# EAGLE schematic Channel Display v2 (EAGLE 6.6.0)
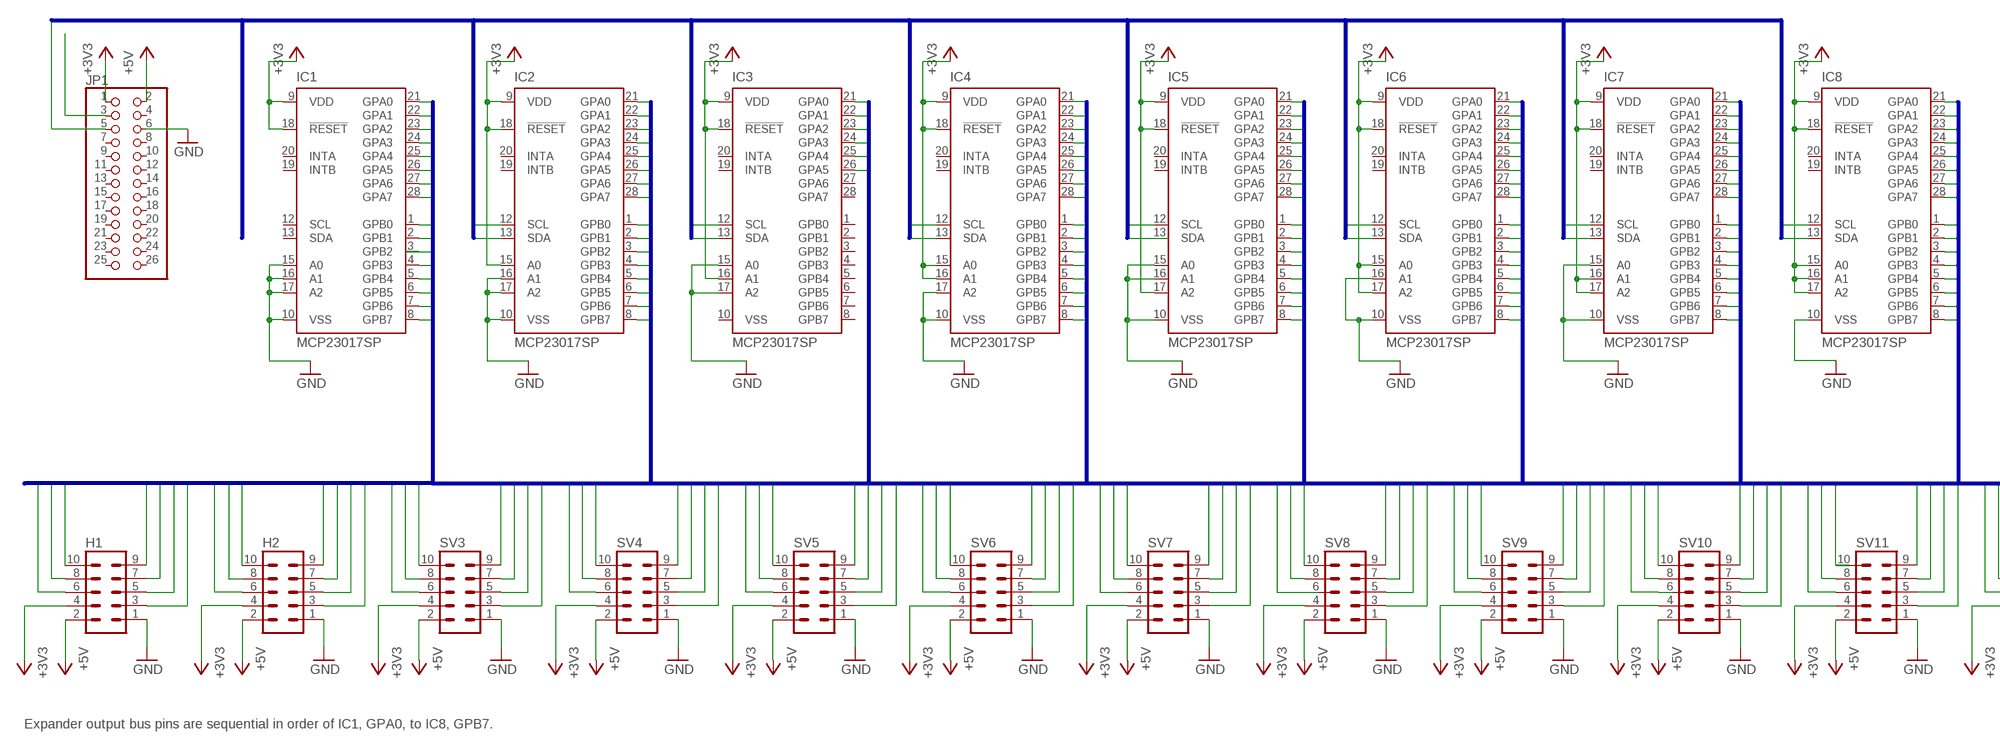
[diagram p0: schematic, sheet 1, part 1 of 2]
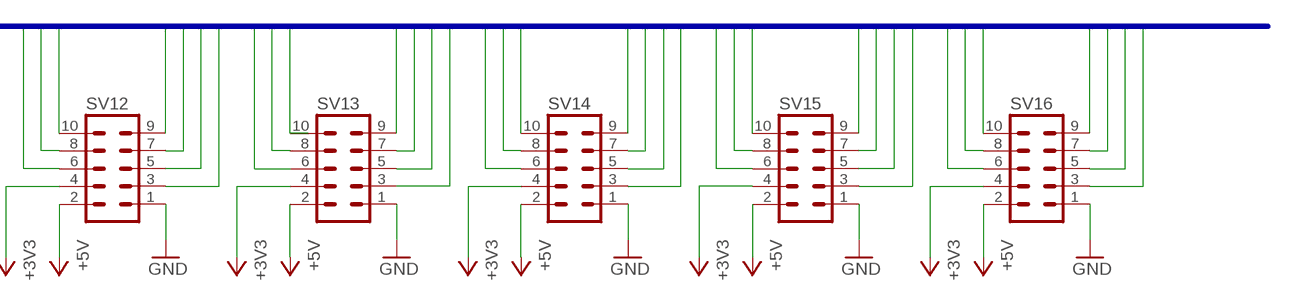
[diagram p1: schematic, sheet 1, part 2 of 2]

## Parts
H1  MA05-2  [MA05-2]
H2  MA05-2  [MA05-2]
IC1  MCP23017SP  [DIL28-3]
IC2  MCP23017SP  [DIL28-3]
IC3  MCP23017SP  [DIL28-3]
IC4  MCP23017SP  [DIL28-3]
IC5  MCP23017SP  [DIL28-3]
IC6  MCP23017SP  [DIL28-3]
IC7  MCP23017SP  [DIL28-3]
IC8  MCP23017SP  [DIL28-3]
JP1  PINHD-2X13  [2X13]
SV3  MA05-2  [MA05-2]
SV4  MA05-2  [MA05-2]
SV5  MA05-2  [MA05-2]
SV6  MA05-2  [MA05-2]
SV7  MA05-2  [MA05-2]
SV8  MA05-2  [MA05-2]
SV9  MA05-2  [MA05-2]
SV10  MA05-2  [MA05-2]
SV11  MA05-2  [MA05-2]
SV12  MA05-2  [MA05-2]
SV13  MA05-2  [MA05-2]
SV14  MA05-2  [MA05-2]
SV15  MA05-2  [MA05-2]
SV16  MA05-2  [MA05-2]

## Nets
+3V3: H1.4 H2.4 IC1.9(VDD) IC1.18(!RESET) IC2.9(VDD) IC2.15(A0) IC2.18(!RESET) IC3.9(VDD) IC3.16(A1) IC3.18(!RESET) IC4.9(VDD) IC4.15(A0) IC4.16(A1) IC4.18(!RESET) IC5.9(VDD) IC5.17(A2) IC5.18(!RESET) IC6.9(VDD) IC6.15(A0) IC6.17(A2) IC6.18(!RESET) IC7.9(VDD) IC7.16(A1) IC7.17(A2) IC7.18(!RESET) IC8.9(VDD) IC8.15(A0) IC8.16(A1) IC8.17(A2) IC8.18(!RESET) JP1.1 SV3.4 SV4.4 SV5.4 SV6.4 SV7.4 SV8.4 SV9.4 SV10.4 SV11.4 SV12.4 SV13.4 SV14.4 SV15.4 SV16.4
+5V: H1.2 H2.2 JP1.2 SV3.2 SV4.2 SV5.2 SV6.2 SV7.2 SV8.2 SV9.2 SV10.2 SV11.2 SV12.2 SV13.2 SV14.2 SV15.2 SV16.2
B$1: IC2.12(SCL) IC2.13(SDA) IC3.12(SCL) IC3.13(SDA) IC4.12(SCL) IC4.13(SDA) IC5.12(SCL) IC6.12(SCL) IC6.13(SDA) IC7.12(SCL) IC7.13(SDA) IC8.12(SCL) IC8.13(SDA) JP1.3 JP1.5
B$2: H1.3 H1.5 H1.6 H1.7 H1.8 H1.9 H1.10 H2.3 H2.5 H2.6 H2.7 H2.8 H2.9 H2.10 IC1.1(GPB0) IC1.2(GPB1) IC1.4(GPB3) IC1.5(GPB4) IC1.6(GPB5) IC1.7(GPB6) IC1.8(GPB7) IC1.21(GPA0) IC1.22(GPA1) IC1.23(GPA2) IC1.24(GPA3) IC1.25(GPA4) IC1.26(GPA5) IC1.27(GPA6) IC1.28(GPA7) IC2.1(GPB0) IC2.2(GPB1) IC2.3(GPB2) IC2.4(GPB3) IC2.5(GPB4) IC2.6(GPB5) IC2.7(GPB6) IC2.8(GPB7) IC2.21(GPA0) IC2.22(GPA1) IC2.23(GPA2) IC2.24(GPA3) IC2.25(GPA4) IC2.26(GPA5) IC2.27(GPA6) IC2.28(GPA7) IC3.21(GPA0) IC3.22(GPA1) IC3.23(GPA2) IC3.24(GPA3) IC3.25(GPA4) IC3.26(GPA5) IC4.1(GPB0) IC4.2(GPB1) IC4.3(GPB2) IC4.4(GPB3) IC4.5(GPB4) IC4.6(GPB5) IC4.7(GPB6) IC4.8(GPB7) IC4.21(GPA0) IC4.22(GPA1) IC4.23(GPA2) IC4.24(GPA3) IC4.25(GPA4) IC4.26(GPA5) IC4.27(GPA6) IC4.28(GPA7) IC5.1(GPB0) IC5.2(GPB1) IC5.3(GPB2) IC5.4(GPB3) IC5.5(GPB4) IC5.6(GPB5) IC5.7(GPB6) IC5.8(GPB7) IC5.21(GPA0) IC5.22(GPA1) IC5.23(GPA2) IC5.24(GPA3) IC5.25(GPA4) IC5.26(GPA5) IC5.27(GPA6) IC5.28(GPA7) IC6.1(GPB0) IC6.2(GPB1) IC6.3(GPB2) IC6.4(GPB3) IC6.5(GPB4) IC6.6(GPB5) IC6.7(GPB6) IC6.8(GPB7) IC6.21(GPA0) IC6.22(GPA1) IC6.23(GPA2) IC6.24(GPA3) IC6.25(GPA4) IC6.26(GPA5) IC6.27(GPA6) IC6.28(GPA7) IC7.1(GPB0) IC7.2(GPB1) IC7.3(GPB2) IC7.4(GPB3) IC7.5(GPB4) IC7.6(GPB5) IC7.7(GPB6) IC7.8(GPB7) IC7.21(GPA0) IC7.22(GPA1) IC7.23(GPA2) IC7.24(GPA3) IC7.25(GPA4) IC7.26(GPA5) IC7.27(GPA6) IC7.28(GPA7) IC8.1(GPB0) IC8.2(GPB1) IC8.3(GPB2) IC8.4(GPB3) IC8.5(GPB4) IC8.6(GPB5) IC8.7(GPB6) IC8.8(GPB7) IC8.21(GPA0) IC8.22(GPA1) IC8.23(GPA2) IC8.24(GPA3) IC8.25(GPA4) IC8.26(GPA5) IC8.27(GPA6) IC8.28(GPA7) SV3.3 SV3.5 SV3.6 SV3.7 SV3.8 SV3.9 SV3.10 SV4.3 SV4.5 SV4.6 SV4.7 SV4.8 SV4.9 SV4.10 SV5.3 SV5.5 SV5.6 SV5.7 SV5.8 SV5.9 SV5.10 SV6.3 SV6.5 SV6.6 SV6.7 SV6.8 SV6.9 SV6.10 SV7.3 SV7.5 SV7.6 SV7.7 SV7.8 SV7.9 SV7.10 SV8.3 SV8.5 SV8.7 SV8.8 SV8.9 SV8.10 SV9.3 SV9.5 SV9.6 SV9.7 SV9.8 SV9.9 SV9.10 SV10.3 SV10.5 SV10.6 SV10.7 SV10.8 SV10.9 SV10.10 SV11.3 SV11.5 SV11.6 SV11.7 SV11.8 SV11.9 SV12.3 SV12.5 SV12.6 SV12.7 SV12.8 SV12.9 SV12.10 SV13.3 SV13.5 SV13.6 SV13.7 SV13.8 SV13.9 SV14.3 SV14.5 SV14.6 SV14.7 SV14.8 SV14.9 SV14.10 SV15.3 SV15.5 SV15.6 SV15.7 SV15.8 SV15.9 SV15.10 SV16.3 SV16.5 SV16.6 SV16.7 SV16.8 SV16.9 SV16.10
GND: H1.1 H2.1 IC1.10(VSS) IC1.15(A0) IC1.16(A1) IC1.17(A2) IC2.10(VSS) IC2.16(A1) IC2.17(A2) IC3.15(A0) IC3.17(A2) IC4.10(VSS) IC4.17(A2) IC5.10(VSS) IC5.15(A0) IC5.16(A1) IC6.10(VSS) IC6.16(A1) IC7.10(VSS) IC7.15(A0) IC8.10(VSS) JP1.6 SV3.1 SV4.1 SV5.1 SV6.1 SV7.1 SV8.1 SV9.1 SV10.1 SV11.1 SV12.1 SV13.1 SV14.1 SV15.1 SV16.1
Unconnected: IC1.3(GPB2) IC1.12(SCL) IC1.13(SDA) IC1.19(INTB) IC1.20(INTA) IC2.19(INTB) IC2.20(INTA) IC3.1(GPB0) IC3.2(GPB1) IC3.3(GPB2) IC3.4(GPB3) IC3.5(GPB4) IC3.6(GPB5) IC3.7(GPB6) IC3.8(GPB7) IC3.19(INTB) IC3.20(INTA) IC3.27(GPA6) IC3.28(GPA7) IC4.19(INTB) IC4.20(INTA) IC5.13(SDA) IC5.19(INTB) IC5.20(INTA) IC6.19(INTB) IC6.20(INTA) IC7.19(INTB) IC7.20(INTA) IC8.19(INTB) IC8.20(INTA) JP1.4 JP1.7 JP1.8 JP1.9 JP1.10 JP1.11 JP1.12 JP1.13 JP1.14 JP1.15 JP1.16 JP1.17 JP1.18 JP1.19 JP1.20 JP1.21 JP1.22 JP1.23 JP1.24 JP1.25 JP1.26 SV8.6 SV11.10 SV13.10

## Buses
B$1
B$2

## Notes on the sheet
- Expander output bus pins are sequential in order of IC1, GPA0, to IC8, GPB7.

## Power pins joined to a net without a drawn wire
VSS: IC3.10(VSS)

## Library data of the parts
H1 H2 SV3-SV16 = con-lstb:MA05-2: PIN HEADER; OC_FARNELL: unknown; OC_NEWARK: unknown
IC1-IC8 = adafruit:MCP23017: http://ww1.microchip.com/downloads/en/DeviceDoc/21952a.pdf Source: http://ww1.microchip.com/downloads/en/DeviceDoc/21952a.pdf
JP1 = pinhead:PINHD-2X13: PIN HEADER